# EAGLE design cytron dip (EAGLE 9.3.1)
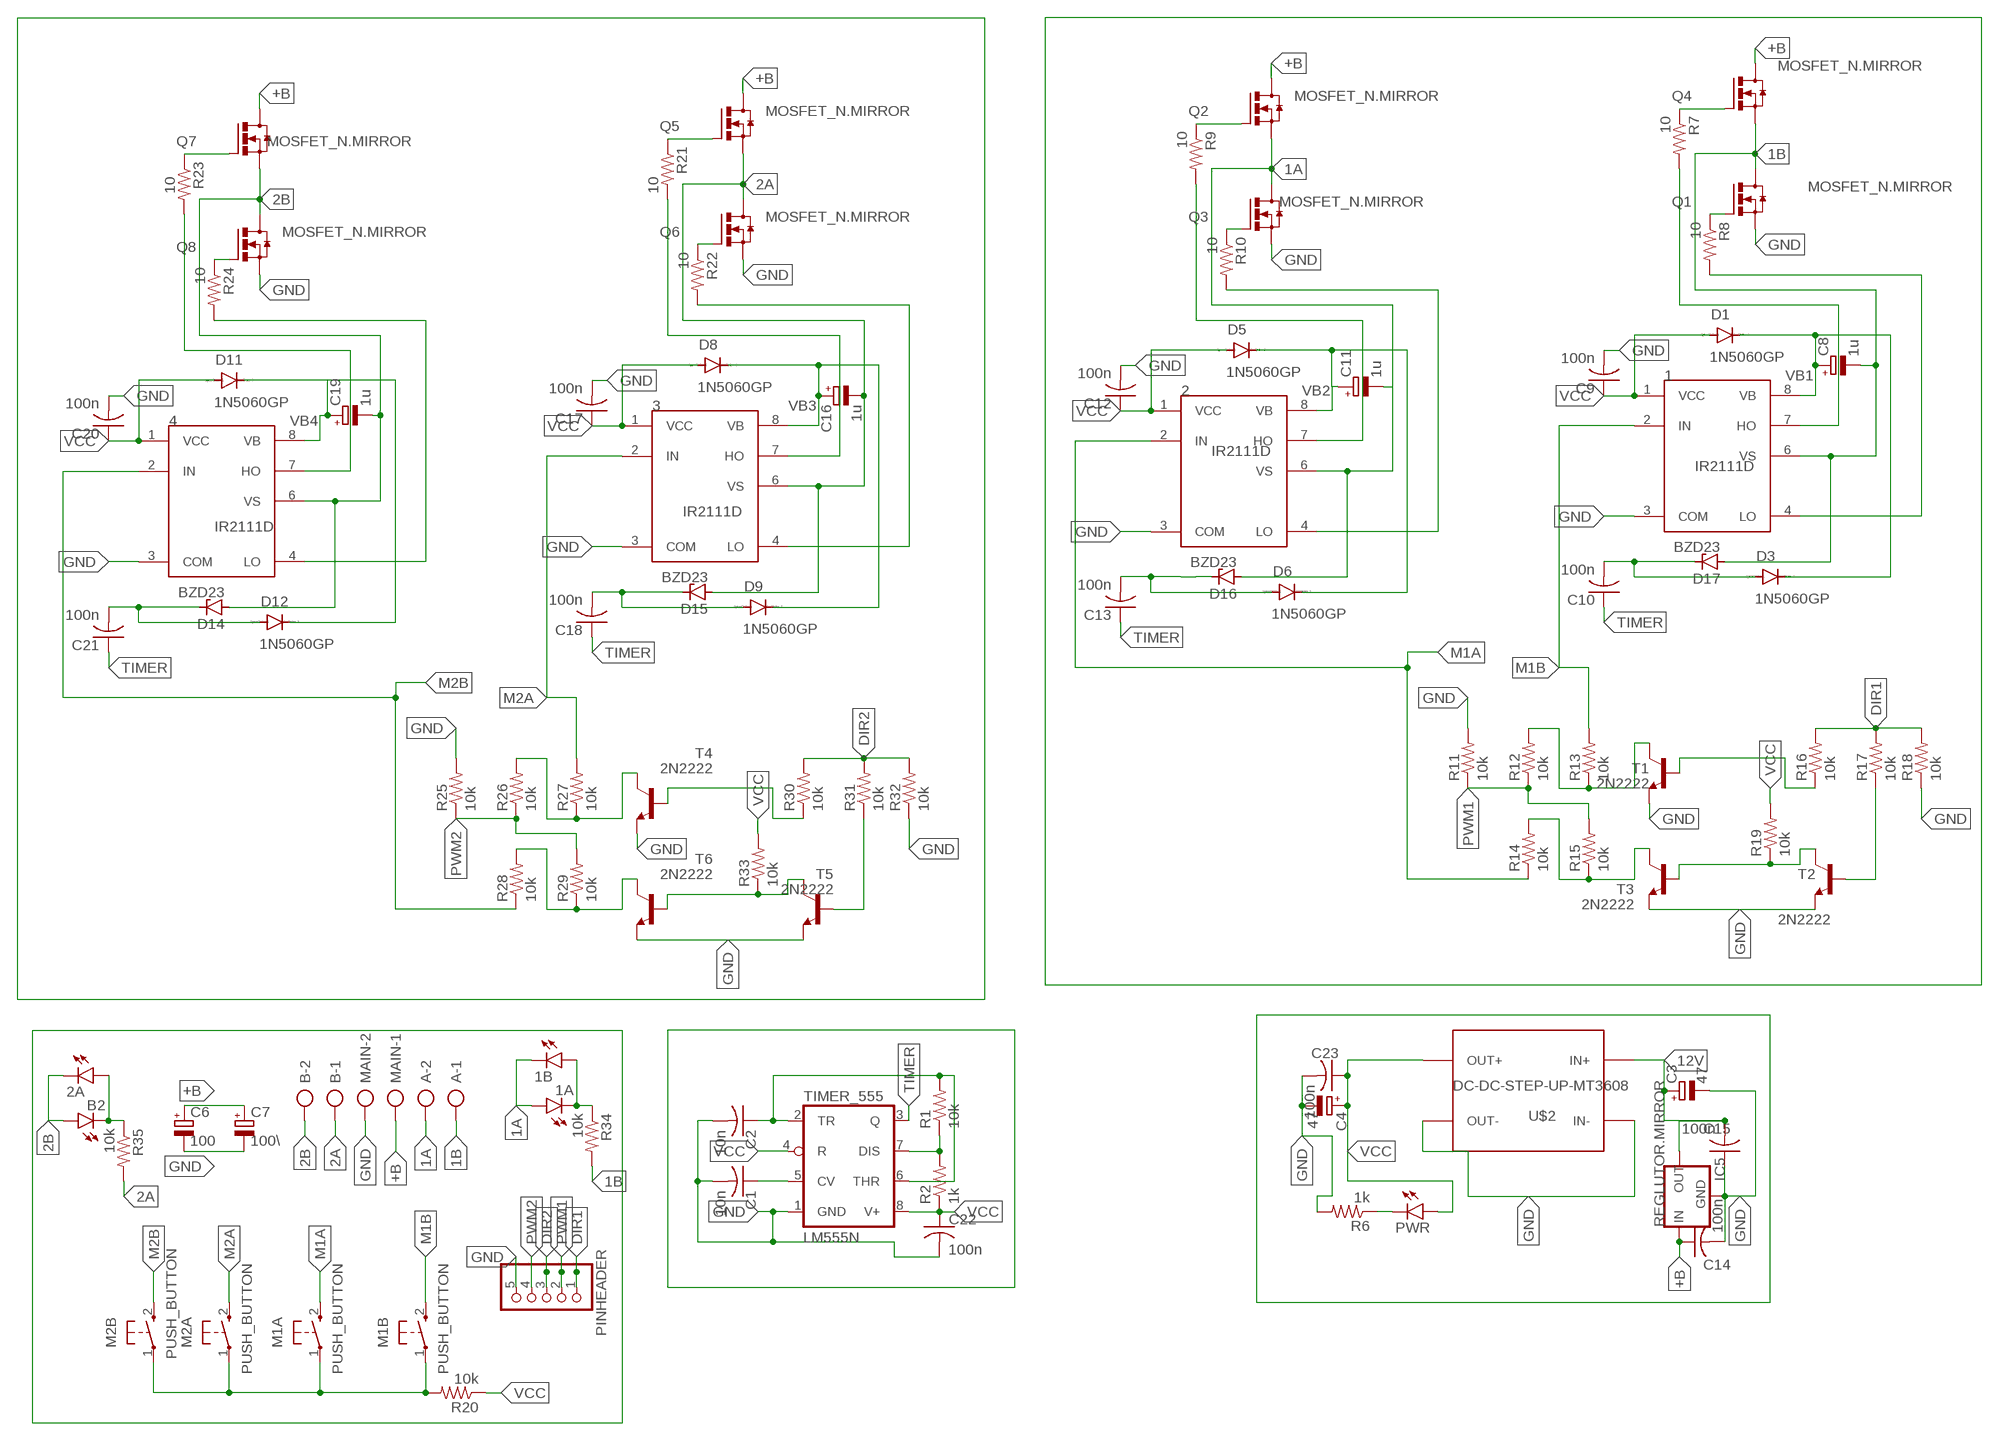
[diagram p0: schematic, sheet 1]

## Parts
1  IR2111D  [DIL08]
1A  LED3MM  [LED3MM]
1B  LED3MM  [LED3MM]
2  IR2111D  [DIL08]
2A  LED3MM  [LED3MM]
3  IR2111D  [DIL08]
4  IR2111D  [DIL08]
A  AK300/22  [XTALRR488W60L1090T465H350B]
B  AK300/22  [XTALRR488W60L1090T465H350B]
B2  LED3MM  [LED3MM]
C1  10n  C-US025-025X050  [C025-025X050]
C2  10n  C-US025-025X050  [C025-025X050]
C3  47  CPOL-EUE5-10.5  [E5-10,5]
C4  47  CPOL-EUE5-10.5  [E5-10,5]
C6  100  CPOL-EUE5-10.5  [E5-10,5]
C7  100\  CPOL-EUE5-10.5  [E5-10,5]
C8  1u  CPOL-EUE5-5  [E5-5]
C9  100n  C-US025-025X050  [C025-025X050]
C10  100n  C-US025-025X050  [C025-025X050]
C11  1u  CPOL-EUE5-5  [E5-5]
C12  100n  C-US025-025X050  [C025-025X050]
C13  100n  C-US025-025X050  [C025-025X050]
C14  100n  C-US025-025X050  [C025-025X050]
C15  100n  C-US025-025X050  [C025-025X050]
C16  1u  CPOL-EUE5-5  [E5-5]
C17  100n  C-US025-025X050  [C025-025X050]
C18  100n  C-US025-025X050  [C025-025X050]
C19  1u  CPOL-EUE5-5  [E5-5]
C20  100n  C-US025-025X050  [C025-025X050]
C21  100n  C-US025-025X050  [C025-025X050]
C22  100n  C-US025-025X050  [C025-025X050]
C23  100n  C-US025-025X050  [C025-025X050]
D1  1N5060GP  [DO15-12]
D3  1N5060GP  [DO15-12]
D5  1N5060GP  [DO15-12]
D6  1N5060GP  [DO15-12]
D8  1N5060GP  [DO15-12]
D9  1N5060GP  [DO15-12]
D11  1N5060GP  [DO15-12]
D12  1N5060GP  [DO15-12]
D14  BZD23  [SOD81]
D15  BZD23  [SOD81]
D16  BZD23  [SOD81]
D17  BZD23  [SOD81]
IC5  REGLUTOR.MIRROR  [78XXL.MIRROR]
M1A  PUSH_BUTTON  [B3F-10XX]
M1B  PUSH_BUTTON  [B3F-10XX]
M2A  PUSH_BUTTON  [B3F-10XX]
M2B  PUSH_BUTTON  [B3F-10XX]
MAIN  AK300/22  [XTALRR488W60L1090T465H350B]
PINHEADER  PINHD-1X5  [1X05]
PWR  LED5MM  [LED5MM]
Q1  MOSFET_N.MIRROR  [TO220.MIRROR]
Q2  MOSFET_N.MIRROR  [TO220.MIRROR]
Q3  MOSFET_N.MIRROR  [TO220.MIRROR]
Q4  MOSFET_N.MIRROR  [TO220.MIRROR]
Q5  MOSFET_N.MIRROR  [TO220.MIRROR]
Q6  MOSFET_N.MIRROR  [TO220.MIRROR]
Q7  MOSFET_N.MIRROR  [TO220.MIRROR]
Q8  MOSFET_N.MIRROR  [TO220.MIRROR]
R1  10k  R-US_0204/7  [0204/7]
R2  1k  R-US_0204/7  [0204/7]
R6  1k  R-US_0204/7  [0204/7]
R7  10  R-US_0204/7  [0204/7]
R8  10  R-US_0204/7  [0204/7]
R9  10  R-US_0204/7  [0204/7]
R10  10  R-US_0204/7  [0204/7]
R11  10k  R-US_0204/7  [0204/7]
R12  10k  R-US_0204/7  [0204/7]
R13  10k  R-US_0204/7  [0204/7]
R14  10k  R-US_0204/7  [0204/7]
R15  10k  R-US_0204/7  [0204/7]
R16  10k  R-US_0204/7  [0204/7]
R17  10k  R-US_0204/7  [0204/7]
R18  10k  R-US_0204/7  [0204/7]
R19  10k  R-US_0204/7  [0204/7]
R20  10k  R-US_0204/7  [0204/7]
R21  10  R-US_0204/7  [0204/7]
R22  10  R-US_0204/7  [0204/7]
R23  10  R-US_0204/7  [0204/7]
R24  10  R-US_0204/7  [0204/7]
R25  10k  R-US_0204/7  [0204/7]
R26  10k  R-US_0204/7  [0204/7]
R27  10k  R-US_0204/7  [0204/7]
R28  10k  R-US_0204/7  [0204/7]
R29  10k  R-US_0204/7  [0204/7]
R30  10k  R-US_0204/7  [0204/7]
R31  10k  R-US_0204/7  [0204/7]
R32  10k  R-US_0204/7  [0204/7]
R33  10k  R-US_0204/7  [0204/7]
R34  10k  R-US_0204/7  [0204/7]
R35  10k  R-US_0204/7  [0204/7]
T1  2N2222  [TO18]
T2  2N2222  [TO18]
T3  2N2222  [TO18]
T4  2N2222  [TO18]
T5  2N2222  [TO18]
T6  2N2222  [TO18]
TIMER_555  LM555N  [DIL08]
U$2  DC-DC-STEP-UP-MT3608  [DC-DC-STEP-UP-MT3608]

## Nets
1A: 1A.A 1B.K(C) 2.6(VS) A.2 C11.- D16.A Q2.S Q3.D
1B: 1.6(VS) A.1 C8.- D17.A Q1.D Q4.S R34.2
2A: 3.6(VS) B.1 C16.- D15.A Q5.S Q6.D R35.2
2B: 2A.K(C) 4.6(VS) B2.A B.2 C19.- D14.A Q7.S Q8.D
12V: C3.+ C15.2 IC5.OUT U$2.IN+
+B: C6.+ C7.+ C14.1 IC5.IN MAIN.1 Q2.D Q4.D Q5.D Q7.D
DIR1: PINHEADER.1 R16.2 R17.2 R18.2
DIR2: PINHEADER.3 R30.2 R31.2 R32.2
GND: 1.3(COM) 2.3(COM) 3.3(COM) 4.3(COM) C1.2 C2.2 C3.- C4.- C6.- C7.- C9.2 C12.2 C14.2 C15.1 C17.2 C20.2 C22.2 C23.2 IC5.GND MAIN.2 PINHEADER.5 Q1.S Q3.S Q6.S Q8.S R6.2 R11.2 R18.1 R25.2 R32.1 T1.1(E) T2.1(E) T3.1(E) T4.1(E) T5.1(E) T6.1(E) TIMER_555.1(GND) U$2.IN- U$2.OUT-
M1A: 2.2(IN) M1A.2(S) R14.1
M1B: 1.2(IN) M1B.2(S) R13.2
M2A: 3.2(IN) M2A.2(S) R27.2
M2B: 4.2(IN) M2B.2(S) R28.1
N$1: PWR.K(C) R6.1
N$2: C1.1 TIMER_555.5(CV)
N$3: R1.1 R2.2 TIMER_555.7(DIS)
N$4: C2.1 R1.2 TIMER_555.2(TR) TIMER_555.6(THR)
N$6: Q6.G R22.1
N$7: M1A.1(P) M1B.1(P) M2A.1(P) M2B.1(P) R20.2
N$9: Q4.G R7.1
N$10: Q1.G R8.1
N$12: 1.4(LO) R8.2
N$13: 1.7(HO) R7.2
N$14: C10.2 D3.A D17.C
N$15: Q3.G R10.1
N$16: Q2.G R9.1
N$17: 2.4(LO) R10.2
N$18: 2.7(HO) R9.2
N$19: R16.1 T1.2(B)
N$20: C13.2 D6.A D16.C
N$22: R14.2 R15.1 T3.3(C)
N$24: R12.2 R13.1 T1.3(C)
N$25: Q5.G R21.1
N$26: 3.4(LO) R22.2
N$27: R19.1 T2.3(C) T3.2(B)
N$28: R17.1 T2.2(B)
N$30: 3.7(HO) R21.2
N$31: C18.2 D9.A D15.C
N$32: Q8.G R24.1
N$33: Q7.G R23.1
N$34: 4.4(LO) R24.2
N$35: 4.7(HO) R23.2
N$36: C21.2 D12.A D14.C
N$37: R28.2 R29.1 T6.3(C)
N$38: R26.2 R27.1 T4.3(C)
N$39: R30.1 T4.2(B)
N$40: R33.1 T5.3(C) T6.2(B)
N$41: R31.1 T5.2(B)
N$45: 1A.K(C) 1B.A R34.1
N$46: 2A.A B2.K(C) R35.1
PWM1: PINHEADER.2 R11.1 R12.1 R15.2
PWM2: PINHEADER.4 R25.1 R26.1 R29.2
TIMER: C10.1 C13.1 C18.1 C21.1 TIMER_555.3(Q)
VB1: 1.8(VB) C8.+ D1.C D3.C
VB2: 2.8(VB) C11.+ D5.C D6.C
VB3: 3.8(VB) C16.+ D8.C D9.C
VB4: 4.8(VB) C19.+ D11.C D12.C
VCC: 1.1(VCC) 2.1(VCC) 3.1(VCC) 4.1(VCC) C4.+ C9.1 C12.1 C17.1 C20.1 C22.1 C23.1 D1.A D5.A D8.A D11.A PWR.A R2.1 R19.2 R20.1 R33.2 TIMER_555.4(R) TIMER_555.8(V+) U$2.OUT+

## Library data of the parts
1-4 = irs:IR2111
1A 1B 2A B2 PWR = led:LED: LED OSRAM: - CHIPLED LG R971, LG N971, LY N971, LG Q971, LY Q971, LO R971, LY R971 LH N974, LH R974 LS Q976, LO Q976, LY Q976 LO Q996 - Hyper CHIPLED LW Q18S LB Q993, LB Q99A, LB R99A - SideLED LS A670, LO A670, LY A670, LG A670, LP A670 LB A673, LV A673, LT A673, LW A673 LH A674 LY A675 LS A676, LA A676, LO A676, LY A676, LW A676 LS A679, LY A679, LG A679 - Hyper Micro SIDELED® LS Y876, LA Y876, LO Y876, LY Y876 LT Y87S - SmartLED LW L88C, LW L88S LB L89C, LB L89S, LG L890 LS L89K, LO L89K, LY L89K LS L896, LA L896, LO L896, LY L896 - TOPLED LS T670, LO T670, LY T670, LG T670, LP T670 LSG T670, LSP T670, LSY T670, LOP T670, LYG T670 LG T671, LOG T671, LSG T671 LB T673, LV T673, LT T673, LW T673 LH T674 LS T676, LA T676, LO T676, LY T676, LB T676, LH T676, LSB T676, LW T676 LB T67C, LV T67C, LT T67C, LS T67K, LO T67K, LY T67K, LW E67C LS E67B, LA E67B, LO E67B, LY E67B, LB E67C, LV E67C, LT E67C LW T67C LS T679, LY T679, LG T679 LS T770, LO T770, LY T770, LG T770, LP T770 LB T773, LV T773, LT T773, LW T773 LH T774 LS E675, LA E675, LY E675, LS T675 LS T776, LA T776, LO T776, LY T776, LB T776 LHGB T686 LT T68C, LB T68C - Hyper Mini TOPLED® LB M676 - Mini TOPLED Santana® LG M470 LS M47K, LO M47K, LY M47K Source: http://www.osram.convergy.de LUXEON: - LUMILED® LXK2-PW12-R00, LXK2-PW12-S00, LXK2-PW14-U00, LXK2-PW14-V00 LXK2-PM12-R00, LXK2-PM12-S00, LXK2-PM14-U00 LXK2-PE12-Q00, LXK2-PE12-R00, LXK2-PE12-S00, LXK2-PE14-T00, LXK2-PE14-U00 LXK2-PB12-K00, LXK2-PB12-L00, LXK2-PB12-M00, LXK2-PB14-N00, LXK2-PB14-P00, LXK2-PB14-Q00 LXK2-PR12-L00, LXK2-PR12-M00, LXK2-PR14-Q00, LXK2-PR14-R00 LXK2-PD12-Q00, LXK2-PD12-R00, LXK2-PD12-S00 LXK2-PH12-R00, LXK2-PH12-S00 LXK2-PL12-P00, LXK2-PL12-Q00, LXK2-PL12-R00 Source: www.luxeon.com KINGBRIGHT: KA-3528ASYC Source: www.kingbright.com
A B MAIN = con-ptr50056:AK300/2: CONNECTOR
C1 C2 C9 C10 C12-C15 C17 C18 C20-C23 = rcl8:C-US: CAPACITOR, American symbol; SPICEPREFIX: C
C3 C4 C6-C8 C11 C16 C19 = rcl8:CPOL-EU: POLARIZED CAPACITOR, European symbol; SPICEPREFIX: C
D1 D3 D5 D6 D8 D9 D11 D12 = diode:1N5060GP: DIODE controlled avalanche rectifier
D14-D17 = diode:BZD23: Z DIODE
IC5 = MOSFET MIRROR:REGLUTOR.MIRROR
M1A M1B M2A M2B = MIA_LIBRARY (1):PUSH_BUTTON: OMRON SWITCH
PINHEADER = pinhead:PINHD-1X5: PIN HEADER
Q1-Q8 = MIA_LIBRARY (1):MOSFET_N.MIRROR
R1 R2 R6-R35 = rcl8:R-US_: RESISTOR, American symbol; SPICEPREFIX: R
T1-T6 = transistor:2N2222: NPN TRANSISTOR
TIMER_555 = linear:*555: TIMER
U$2 = diy-modules:DC-DC-STEP-UP-MT3608: DC/DC Step-Up Regulator based on MT3608 chip MT3608 datasheet available here: https://www.olimex.com/Products/Breadboarding/BB-PWR-3608/resources/MT3608.pdf Click here to find device on ebay.com <http://www.ebay.com/sch/mt3608+module>

## Board
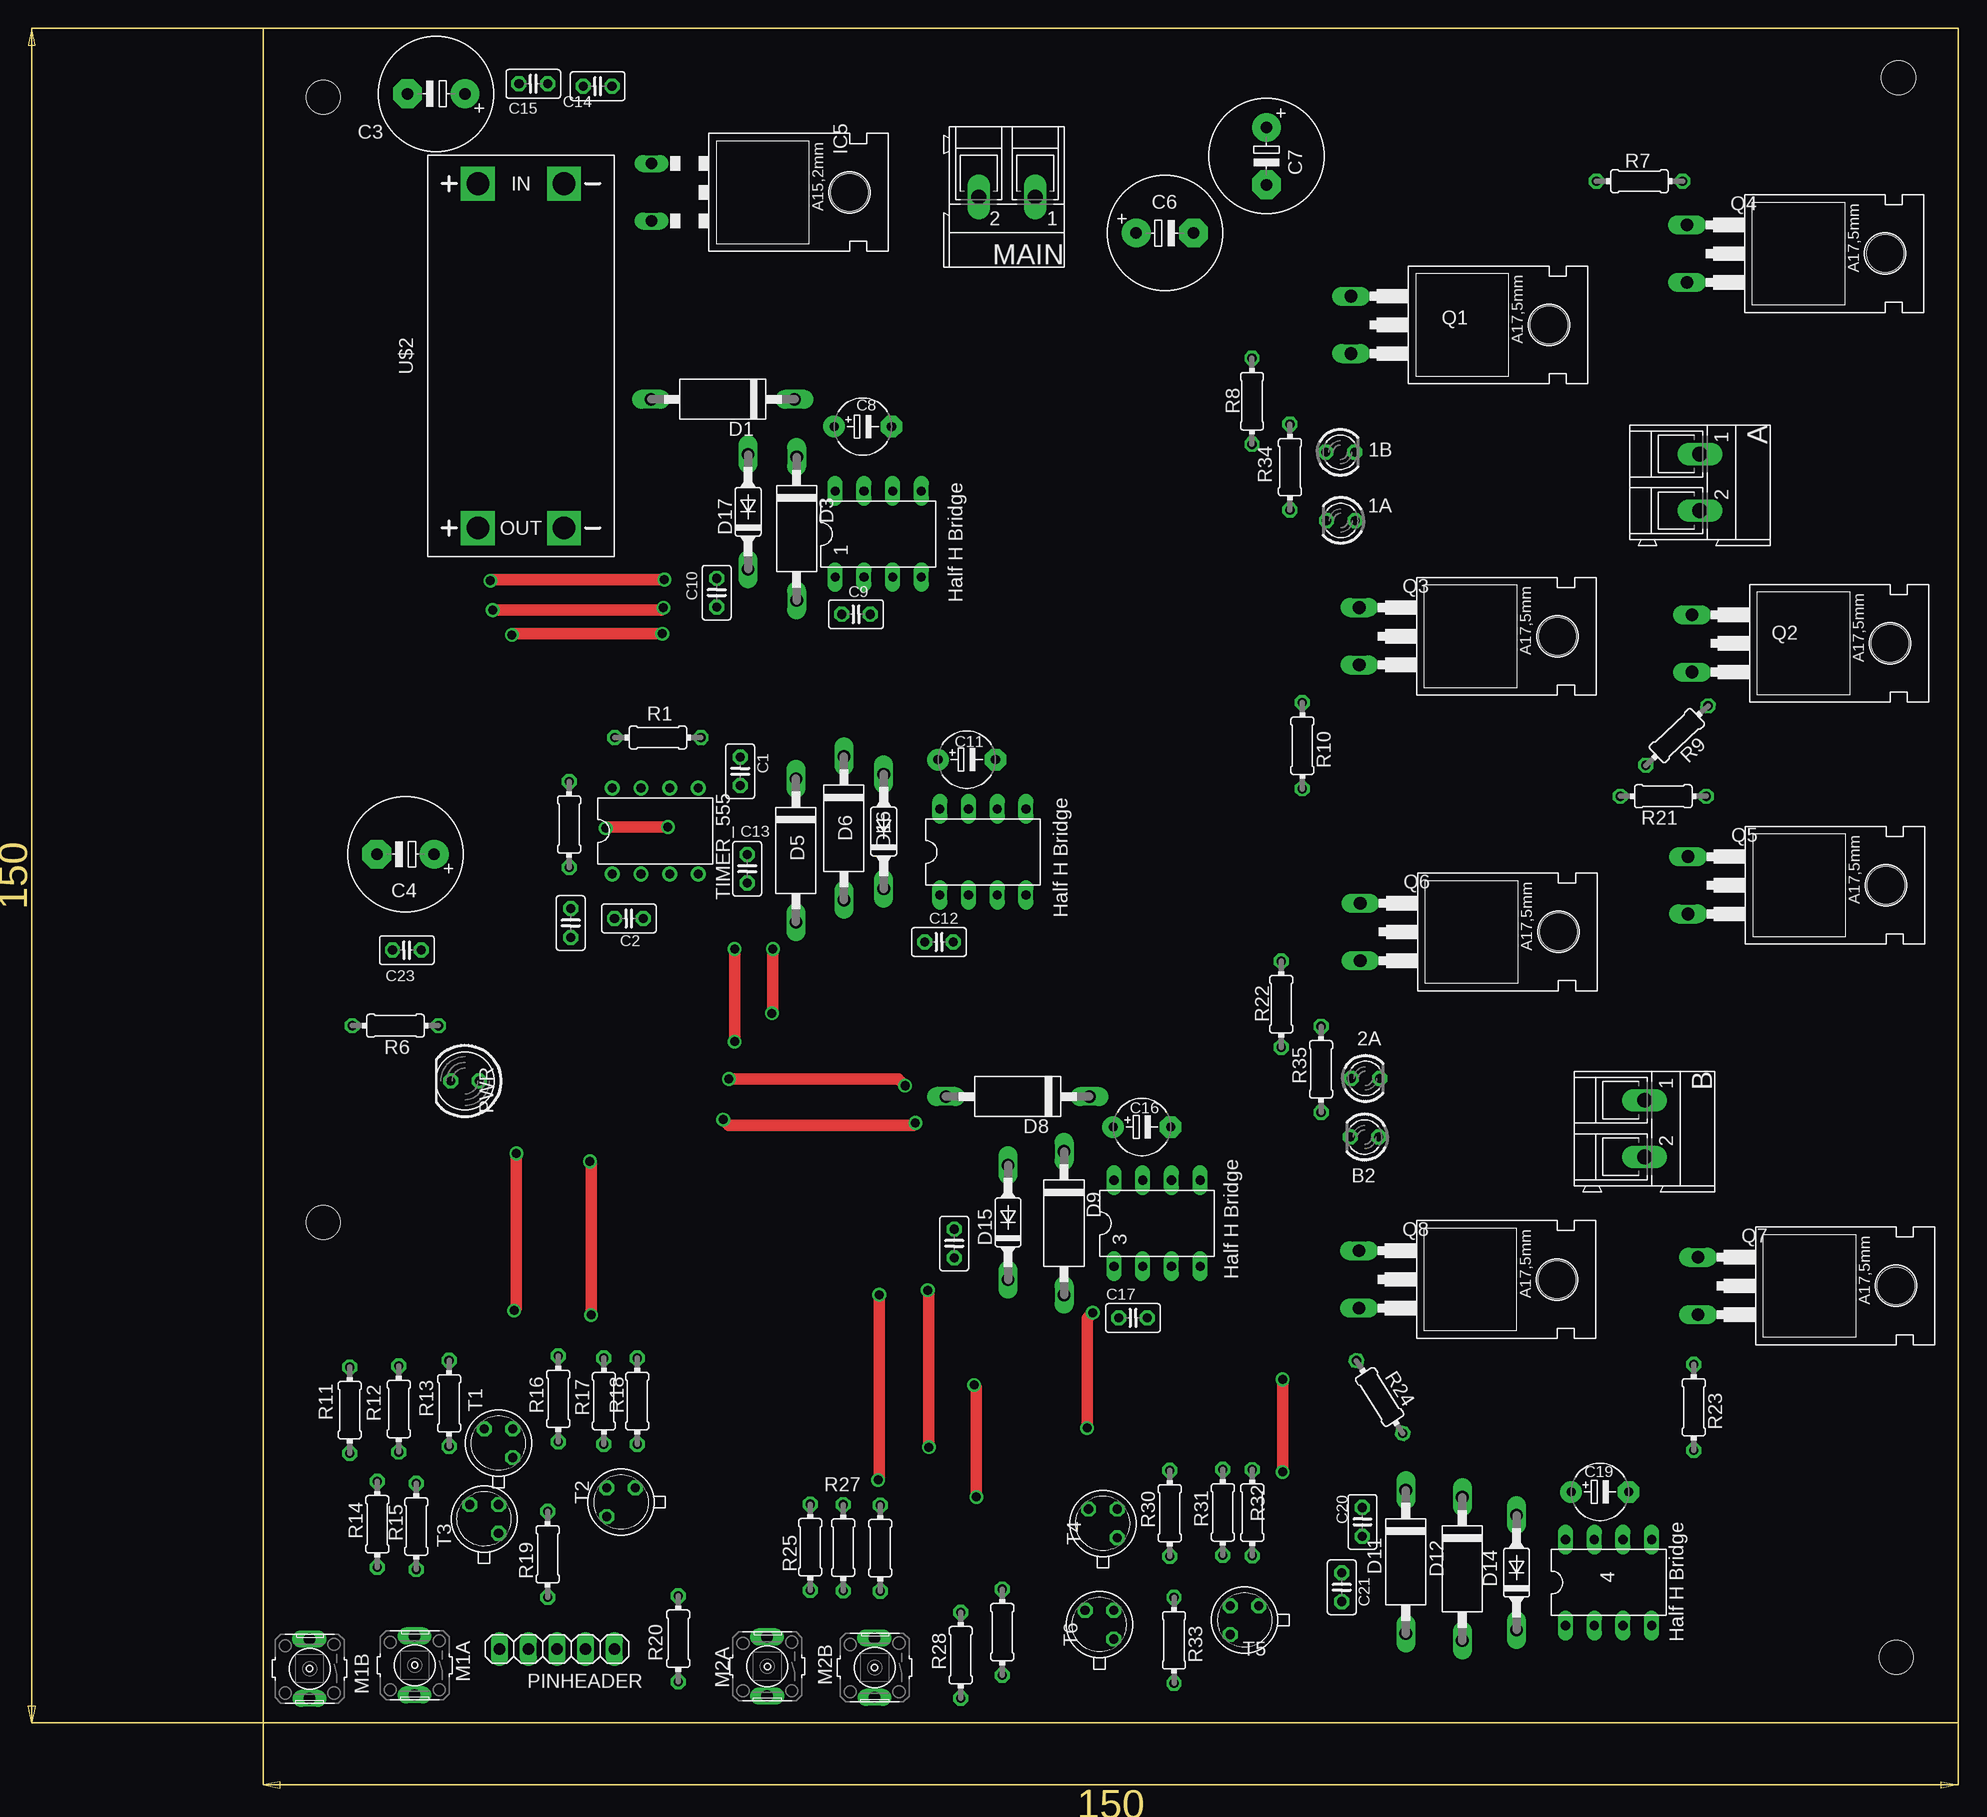
[diagram p1: board, top side]
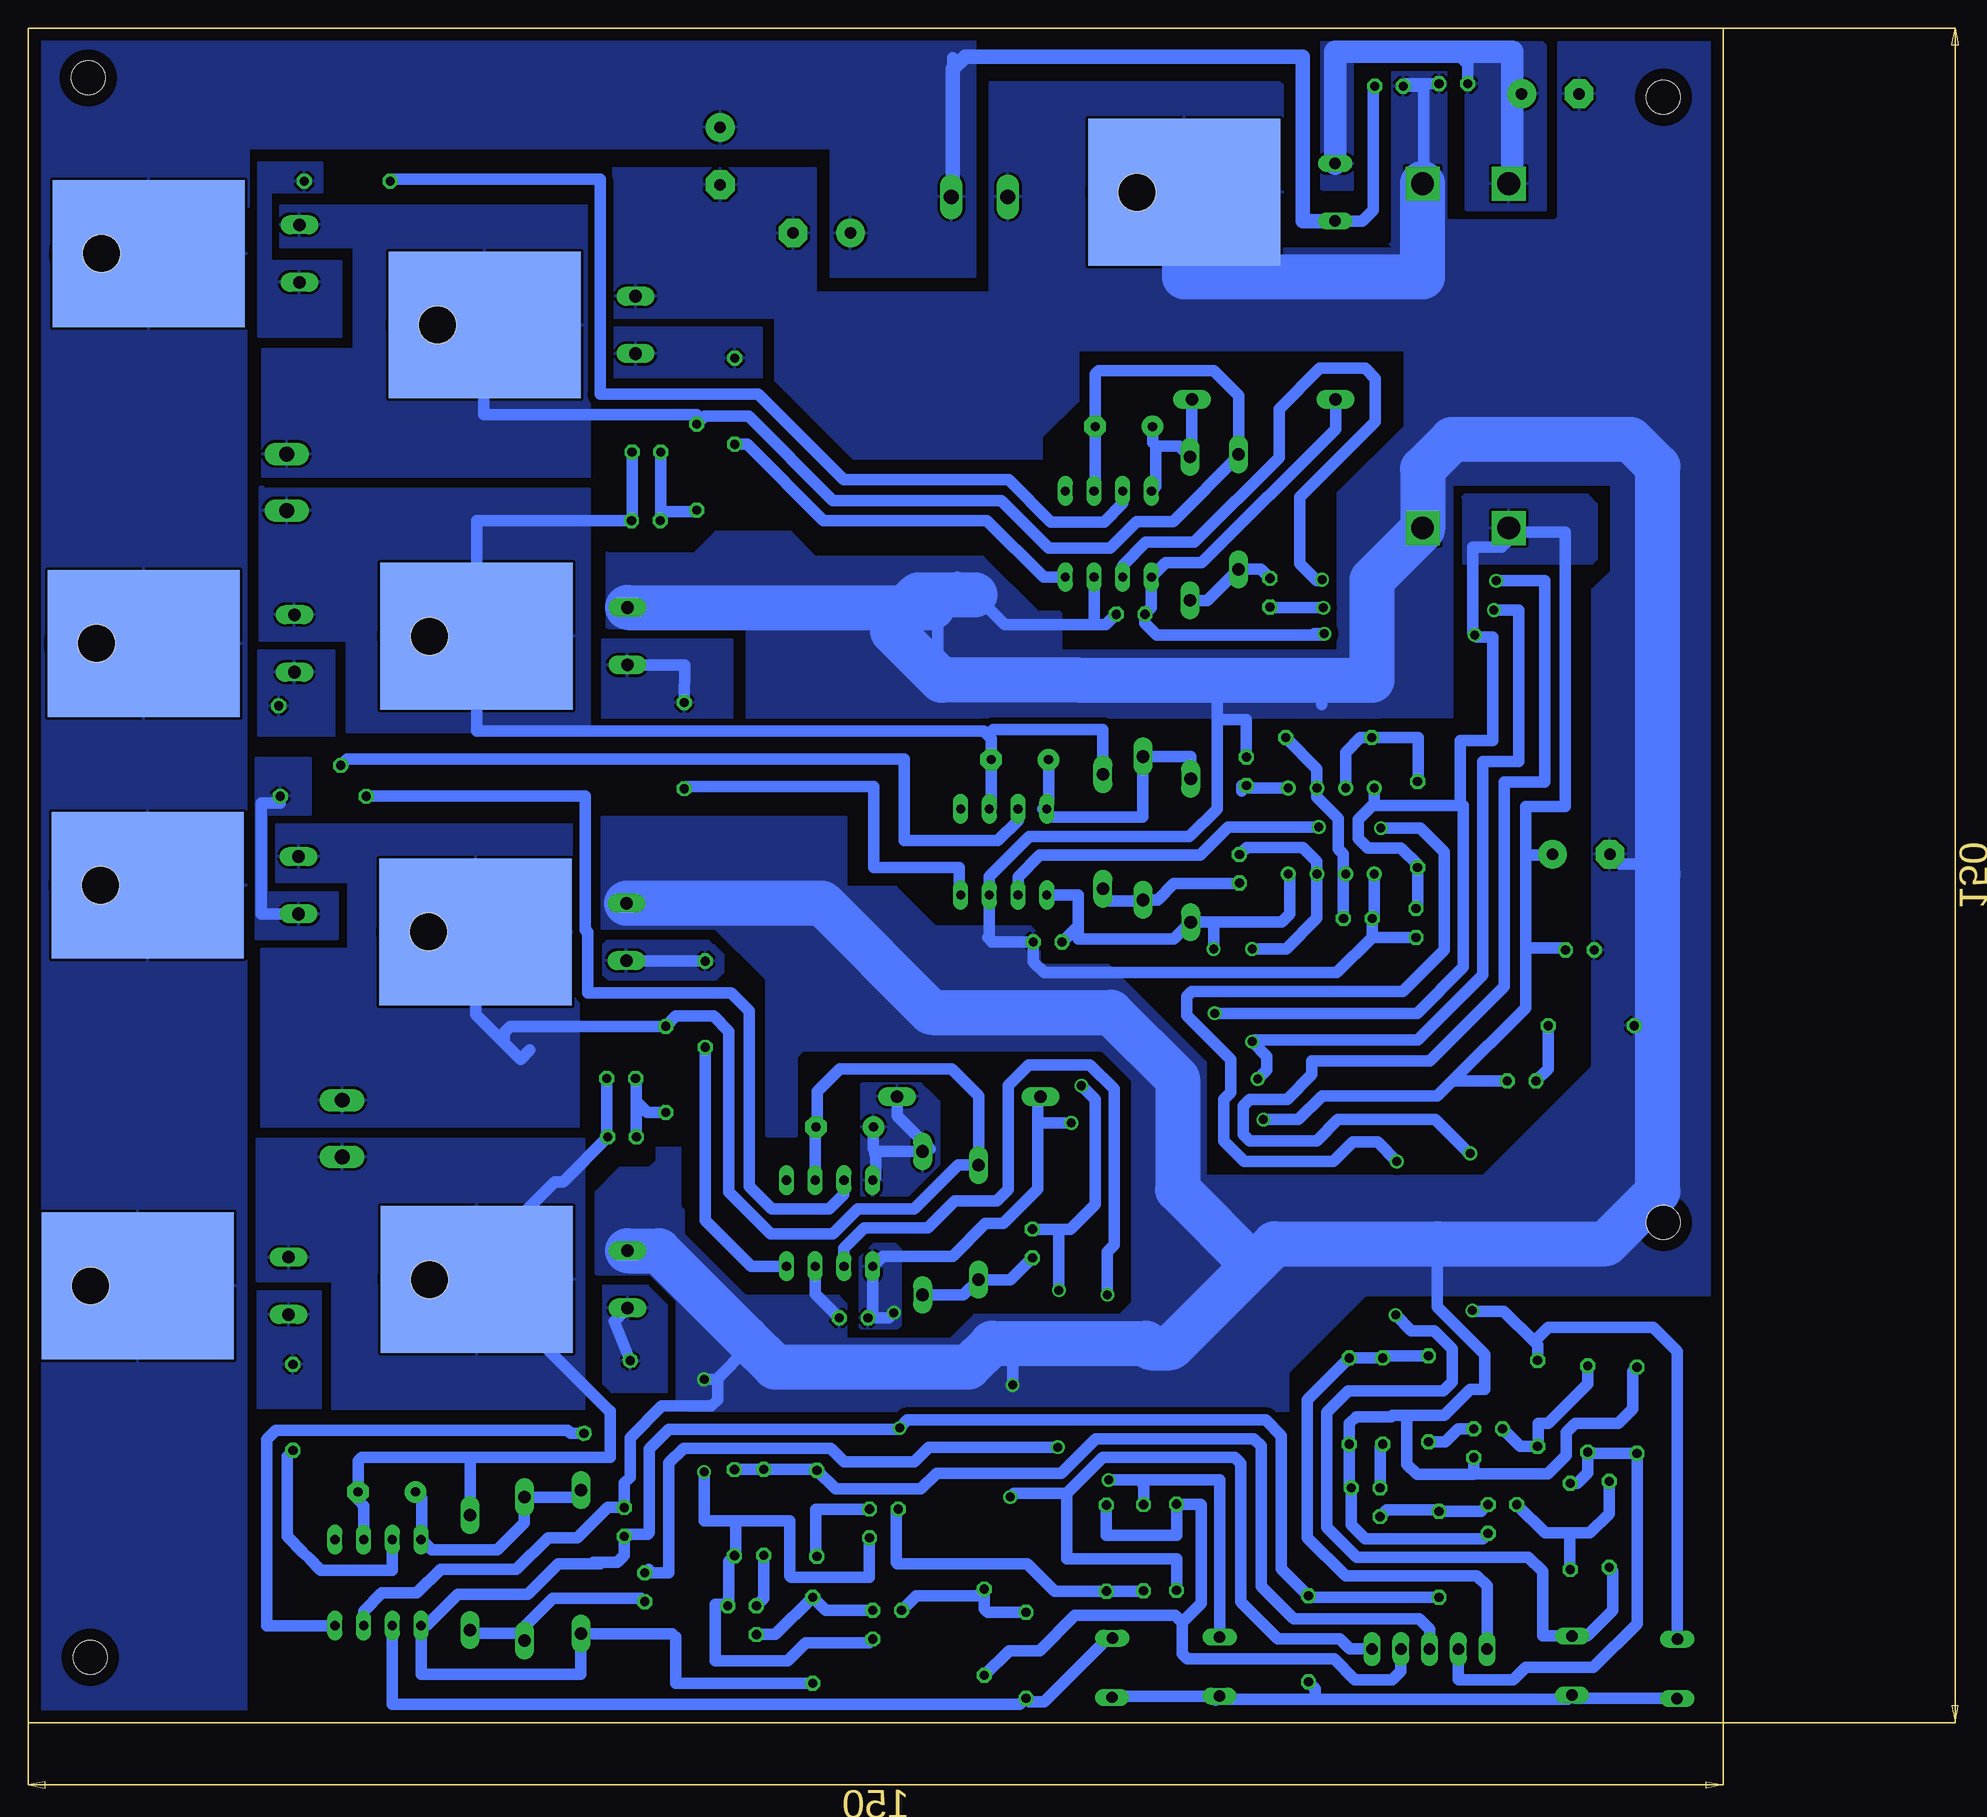
[diagram p2: board, bottom side, seen from below]

Size 150 x 150 mm. Coordinates in mm from the lower left corner, seen from the top.
Outline: 0,0 0,150 150,150 150,0 0,0
Copper layers (1*16): Top 0.035mm / dielectric 1.5mm / Bottom 0.035mm
Design rules "default *": minimum track width 0.015240625mm, minimum drill 0.8mm, track to track 0.6mm, track to pad 0.6mm, pad to pad 0.6mm, via to via 6mil, smd to smd 6mil, copper to edge 40mil, drill to drill 6mil, minimum pad ring 10mil, minimum via ring 8mil, stop-mask expansion 4mil, vias tented up to drill 0mil, thermal gap 10mil
Holes 3 mm at 144.7,145.6 144.5,5.8 5.3,44.3 5.3,143.9

### Footprints (pad centres in the part's own frame; a part is rotated, then mirrored left to right if it is on the bottom)
DIL08 = drill 0.813 long: 1 -3.81,-3.81; 2 -1.27,-3.81; 3 1.27,-3.81; 4 3.81,-3.81; 5 3.81,3.81; 6 1.27,3.81; 7 -1.27,3.81; 8 -3.81,3.81
LED3MM = drill 0.813 octagon: A -1.27,0; K 1.27,0
XTALRR488W60L1090T465H350B = drill 1.321 long: 1 -2.515,-1.27; 2 2.489,-1.27
C025-025X050 = drill 0.813 octagon: 1 -1.27,0; 2 1.27,0
E5-10,5 = drill 1.016 pad 2.54: + -2.54,0 | drill 1.016 pad 2.54 octagon: - 2.54,0
E5-5 = drill 0.813 pad 1.905: + -2.54,0 | drill 0.813 pad 1.905 octagon: - 2.54,0
DO15-12 = drill 1.118 long: A 6.35,0; C -6.35,0
SOD81 = drill 1.118 long: A 5.08,0; C -5.08,0
78XXL.MIRROR = smd 13 x 17 bottom: GND 0,7 | drill 1.016 long: IN 2.54,-6.35; OUT -2.54,-6.35 | hole 3.302: 0,11.176
B3F-10XX = drill 1.016 long: 1 0.013,2.636; 2 0.029,-2.605
1X05 = drill 1.016 long: 1 -5.08,0; 2 -2.54,0; 3 0,0; 4 2.54,0; 5 5.08,0
LED5MM = drill 0.813 octagon: A -1.27,0; K 1.27,0
TO220.MIRROR = smd 13 x 17 bottom: D 0,7 | drill 1.118 long: G 2.54,-6.35; S -2.54,-6.35 | hole 3.302: 0,11.176
0204/7 = drill 0.813 octagon: 1 -3.81,0; 2 3.81,0
TO18 = drill 0.813 octagon: 1 -1.27,-1.27; 2 1.27,-1.27; 3 1.27,1.27
DIL08' = drill 0.813 pad 1.27: 1 -3.81,-3.81; 2 -1.27,-3.81; 3 1.27,-3.81; 4 3.81,-3.81; 5 3.81,3.81; 6 1.27,3.81; 7 -1.27,3.81; 8 -3.81,3.81
DC-DC-STEP-UP-MT3608 = drill 2 pad 2.8 square: IN+ 15.24,3.81; IN- 15.24,-3.81; OUT+ -15.24,3.81; OUT- -15.24,-3.81

### Placement (x,y rotation side)
1  54.42,105.23 0 top
1A  95.35,106.43 180 top
1B  95.3,112.47 0 top
2  63.68,77.09 0 top
2A  97.53,57.05 0 top
3  79.09,44.22 0 top
4  119.05,12.42 0 top
A  128.4,109.8 270 top
B  123.5,52.6 270 top
B2  97.45,51.85 180 top
C1  42.2,84.23 90 top
C2  32.35,71.2 180 top
C3  15.3,144.2 180 top
C4  12.58,76.89 180 top
C6  79.78,131.87 0 top
C7  88.77,138.69 270 top
C8  53.05,114.74 0 top
C9  52.45,98.13 0 top
C10  40.12,100.04 90 top
C11  62.25,85.26 0 top
C12  59.79,69.12 0 top
C13  42.82,75.6 270 top
C14  29.59,144.87 180 top
C15  23.89,145.08 180 top
C16  77.75,52.74 0 top
C17  76.96,35.84 0 top
C18  61.14,42.43 270 top
C19  118.28,20.44 0 top
C20  97.26,17.79 90 top
C21  95.44,12 270 top
C22  27.2,70.8 270 top
C23  12.7,68.4 180 top
D1  40.67,117.16 180 top
D3  47.2,105.7 270 top
D5  47.13,77.23 270 top
D6  51.37,79.19 270 top
D8  66.76,55.44 180 top
D9  70.86,44.23 270 top
D11  101.1,14.25 270 top
D12  106.1,13.62 270 top
D14  110.9,13.3 90 top
D15  65.9,44.3 90 top
D16  54.9,78.9 90 top
D17  42.9,107.2 90 top
IC5  40.7,135.48 270 top
M1A  13.4,5.1 180 top
M1B  4.1,4.8 180 top
M2A  44.6,5 180 top
M2B  54.1,4.9 180 top
MAIN  65.8,133.8 180 top
PINHEADER  25.99,6.54 0 top
PWR  17.85,56.81 180 top
Q1  102.6,123.74 270 top
Q2  132.79,95.55 270 top
Q3  103.33,96.18 270 top
Q4  132.35,130.05 270 top
Q5  132.42,74.14 270 top
Q6  103.42,70.01 270 top
Q7  133.32,38.68 270 top
Q8  103.32,39.25 270 top
R1  34.92,87.22 0 top
R2  27.06,79.52 90 top
R6  11.69,61.71 180 top
R7  121.78,136.46 180 top
R8  87.49,116.98 270 top
R9  125.09,87.39 223.7 top
R10  91.95,86.49 270 top
R11  7.64,27.68 90 top
R12  11.99,27.78 90 top
R13  16.44,28.28 90 top
R14  10.09,17.58 90 top
R15  13.54,17.38 90 top
R16  26.09,28.68 90 top
R17  30.14,28.48 90 top
R18  33.09,28.48 90 top
R19  25.16,14.92 270 top
R20  36.71,7.45 270 top
R21  123.89,82.02 180 top
R22  90.08,63.61 270 top
R23  126.58,27.93 270 top
R24  98.78,28.85 302.5 top
R25  48.39,15.55 270 top
R26  54.59,15.47 270 top
R27  51.31,15.51 90 top
R28  61.71,5.99 90 top
R29  65.39,8.03 270 top
R30  80.21,18.55 90 top
R31  84.91,18.63 90 top
R32  87.51,18.61 90 top
R33  80.59,7.31 270 top
R34  90.85,111.15 90 top
R35  93.6,57.85 90 top
T1  20.81,24.75 90 top
T2  31.65,19.53 180 top
T3  19.55,18.05 90 top
T4  74.29,17.65 90 top
T5  86.83,9.09 180 top
T6  73.99,8.69 90 top
TIMER_555  LM555N  [DIL08']  34.69,78.95 0 top
U$2  22.8,121 90 top

### Tracks (layer width: path | path; a pad name or v marks a point on that pad's centre or on a via)
1A
  Bottom 1.016: 1B.K 96.57,106.43 1A.A 110.33,106.43 Q3.D 110.33,87.8 65.45,87.8 65.09,87.44 | D16.A 54.9,87.9 64.63,87.9 65.09,87.44 | 65.09,87.44 64.79,87.14 C11.- 64.79,81.06 2.6
  pour Bottom (isolate 0.406): 100.3,109.2 129.2,109.2 129.2,109.4 129.5,109.4 129.5,95.8 121.8,95.8 121.8,87.7 100.3,87.7
1B
  Bottom 1.016: Q1.D 109.08,123.74 109.08,121.79 109.7,121.17 109.7,115.8 101.02,115.8 101.02,115.78 90.85,115.78 R34.2 90.15,115.66 86.25,115.66 78.8,108.2 63.91,108.2 59.7,104 54.25,104 51.9,106.35 48.7,106.35 42.84,112.22 D17.A 42.9,117.5 45.1,119.7 55.29,119.7 55.59,119.4 C8.- 55.59,109.14 1.6
  pour Bottom (isolate 0.406): 127.7,130.6 121.2,130.6 121.2,121.6 129.3,121.6 129.3,110.3 100.3,110.3 100.3,134.3 127.7,134.3
2A
  Bottom 1.016: 105.6,59.56 106.43,58.73 107.9,60.2 | 107.9,60.2 110.42,62.72 Q6.D | 107.9,60.2 107.9,61.1 107.34,61.66 R35.2 92.7,62.56 89.36,62.56 88,61.2 88,47 84.3,43.3 78.8,43.3 76.6,45.5 71.58,45.5 67.7,49.38 D15.A 65.9,55.5 68.3,57.9 78.19,57.9 80.19,55.9 80.19,52.84 C16.- 80.36,52.67 3.6
  pour Bottom (isolate 0.406): 128.05,79.5 128.05,74.45 121.7,74.45 121.7,68.5 129.4,68.5 129.4,52.8 101.3,52.8 101.3,79.5
2B
  Bottom 1.016: Q8.D 110.47,39.1 111.1,39.1 111.1,40.2 103.4,47.9 102.67,47.9 B2.A 98.8,51.93 2A.K | 110.9,23.5 D14.A | 110.9,23.5 120.5,23.5 120.82,23.18 C19.- 120.82,19.72 120.3,19.2 120.3,16.25 4.6 | Q8.D 106.02,39.25 | Q8.D 110.25,39.25 98.6,27.6 98.5,27.6 98.5,23.5 110.9,23.5
  pour Bottom (isolate 0.406): 129.8,39.1 123.1,39.1 123.1,27.8 100.8,27.8 100.8,51.7 129.8,51.7
12V
  Bottom 1.016: C15.2 22.62,146.82 23.7,147.9
  Bottom 2: IC5.OUT 34.35,147.9 23.7,147.9 18.69,147.9 18.69,136.54 U$2.IN+
  pour Bottom (isolate 0.406): 22.8,147.1 22.8,134 22.7,133.9 15.7,133.9 15.7,148.5 16.2,149 35.4,149 35.6,148.8 35.6,135.8 35.5,135.7 32.8,135.7 32.8,146.8 33.1,147.1
+B
  Bottom 0.406: 143.51,95.6 142.6,95.6 142.3,95.6 142.3,92.9 144.2,92.9
  Bottom 1.016: 68.2,147.4 68.2,146.4 | 68.2,136.1 68.5,135.8 68.5,135.25 MAIN.1 | C14.1 31,144.73 31,133.9 31.96,132.94 IC5.IN | Q2.D 142.55,95.55 142.6,95.6
  Bottom 1.27: 68.2,136.1 68.2,146.4 67.1,147.5 37.2,147.5 37.2,132.94 IC5.IN
  pour Bottom (isolate 0.406): 66.2,149.8 66.2,128 79,128 79,139.4 130.5,139.4 130.5,134.2 130.7,134 130.7,0.7 149.2,0.7 149.2,149.8
DIR1
  Bottom 1.016: R16.2 29.94,32.49 R17.2 R18.2 36.8,28.58 36.8,16.4 33.4,13 21.8,13 20.91,12.11 PINHEADER.1
DIR2
  Bottom 1.016: R32.2 84.93,22.42 R31.2 80.29,22.44 R30.2 78.55,20.7 71,20.7 69.6,22.1 58.6,22.1 55.55,25.15 41.55,25.15 40.9,24.5 40.9,12.1 38,9.2 26.9,9.2 25.99,8.29 PINHEADER.3
GND  (via drill 0.8)
  Top 1.016: v90.2,22.2 v90.2,30.4 | v63.1,20 63.1,29.7 v62.9,29.9
  Bottom 1.016: 69.52,99.72 70,99.23 70,98.72 | 69.52,99.72 67.8,101.43 66.24,99.86 63.57,97.2 55.4,97.2 | 56.85,92.35 56.9,92.3 69.52,92.3 69.52,99.72 | C9.2 54.65,97.2 55.4,97.2 | 35.55,92.3 35.55,90.15 | TIMER_555.1 30.88,71.2 C2.2 31.08,69.52 | 31.08,69.52 34.2,66.4 60.1,66.4 61.06,67.36 C12.2 64.72,69.12 65.1,69.5 64.95,69.65 2.3 64.95,74.9 61.4,78.45 47.25,78.45 44.8,80.9 44.8,88.8 | 55.4,97.2 55.69,97.49 1.3 | C15.1 28.11,145.08 C14.2 26.52,144.87 26.52,136.33 U$2.IN- | T6.1 75.58,7.1 81.2,7.1 82.8,5.5 89.2,5.5 89.2,10.5 88.38,10.5 88.31,10.57 T5.1 88.01,10.36 88.01,14.3 R32.1 87.4,14.91 87.4,17.9 | T4.1 75.56,12.9 82.5,12.9 82.6,13 82.6,17.9 87.4,17.9 | 45.6,92.3 44.8,91.5 44.8,88.8 | C22.2 31.07,69.53 31.08,69.52 | C1.2 42.2,88.8 44.8,88.8 | C17.2 80.36,37.97 3.3 | C4.- 9.15,76 6.5,76 5.8,76.7 | 5,77.5 5.8,76.7 | 5.8,76.7 5.8,75.1 | 28,27.2 24.7,27.2 22.4,29.5 21.1,29.5 21.1,32.6 25.3,36.8 25.3,42.4 | 28,27.2 29.3,27.2 29.4,27.1 32.5,27.1 33.09,26.51 R18.1 33.09,20.97 T2.1 32.92,17.52 31.7,16.3 21.3,16.3 T3.1 | 28,27.2 28,22.9 27.1,22 22.1,22 22.1,23.46 T1.1 22.08,22.05 15.55,22.05 13.9,23.7 13.9,25.7 13.1,26.5 9.3,26.5 8,27.8 8,31.13 R11.2 | 120.22,8.51 4.3 120.32,9.88 118.7,11.5 115.6,11.5 113.5,13.6 106.8,13.6 104,16.4 101.4,16.4 98.74,19.06 C20.2 | 89,30.5 89,28.6 89.55,28.05 93.95,28.05 96.75,25.25 96.75,21.75 97.26,21.24 C20.2 | 89,30.5 86.45,33.05 86.45,34.05 | v90.2,30.4 89.1,30.4 89,30.5 | PINHEADER.5 33.04,6.54 33.95,7.45 39.45,7.45 42.7,10.7 42.7,22.95 43.25,23.5 54.9,23.5 58.1,20.3 | R25.2 48.39,14.5 58.1,14.5 58.1,20.3 | v63.1,20 62.8,20.3 58.1,20.3 | v62.9,29.9 62.9,31.8 64.7,33.6
  Bottom 1.016: 87.4,17.9 90.2,17.9 v90.2,22.2 | C20.2 97.44,19.06
  Bottom 4: Q3.S 70,98.72 | IC5.GND 47.7,128 26.61,128 U$2.IN- | 66.24,99.86 71.24,99.86 73.5,97.6 73.5,96.6 69.2,92.3 56.9,92.3 45.6,92.3 35.55,92.3 31.11,92.3 31.11,101.16 26.61,105.66 U$2.OUT- 26.61,110.99 24,113.6 8.2,113.6 5.8,111.2 5.8,75.1 5.8,47 10.4,42.4 25.3,42.4 39.7,42.4 41.6,40.5 | Q6.S 79.75,72.55 70.1,62.9 54.2,62.9 48.3,57 48.3,47.2 41.6,40.5 | Q8.S 94.19,41.79 86.45,34.05 83.9,31.5 66.8,31.5 64.7,33.6 51.1,33.6 50.7,33.2 48.9,33.2 41.6,40.5
  pour Bottom (isolate 0.406): 64.9,145.2 64.9,126.6 80.3,126.6 80.3,137.6 98.25,137.6 98.25,124.4 83.9,124.4 83.9,118.8 77,111.9 60.3,111.9 60.3,113.81 57.1,117.01 57.1,145.2
  pour Bottom (isolate 0.406): 39,145 39,121.5 57.7,121.5 57.7,145.2 39.3,145.2 39.1,145
  pour Bottom (isolate 0.406): 98.8,103.6 98.8,97 98.6,97 98.6,96.9 86.4,96.9 86.4,89 30.4,89 30.4,94.9 58.6,94.9 58.6,98.2 58.7,98.3 60.6,98.3 65.5,103.2 80.3,103.2 82.5,105.4 89.2,105.4 91.1,103.5 98.7,103.5
  pour Bottom (isolate 0.406): 44.5,130.5 17.4,130.5 15.6,132.3 14.6,133.3 14.6,137.8 14.6,148.7 14,149.3 1.2,149.3 0.8,148.9 0.8,123.6 0.8,121.5 44.5,121.5
  pour Bottom (isolate 0.406): 31.92,89.02 24,89.02 24,109.6 9.9,109.6 9.9,84.8 0.6,84.8 0.6,125.5 28.2,125.5 28.2,114.8 34.1,108.9 34.1,91.2
  pour Bottom (isolate 0.406): 14.2,133.3 14.5,133 24.5,133 24.5,146.1 29.3,146.1 29.3,131.1 29.5,130.9 26.7,128.1 15,128.1 14.2,128.9
  pour Bottom (isolate 0.406): 99.25,70.3 99.25,80.2 77.6,80.2 77.6,70.3
  pour Bottom (isolate 0.61): 99.8,39.8 99.8,47 97.7,49.1 95.1,49.1 94.4,49.8 94.4,50.9 92.3,50.9 92.3,45.7 92,45.4 92,43.3 86.5,37.8 78.3,37.8 77.6,37.1 77.6,34 68.4,34 66.3,36.1 53.4,36.1 52.3,37.2 52.3,56.8 55,59.5 81.4,59.5 82,58.9 82,52 82.1,51.9 84.6,51.9 84.7,52 84.7,65.8 89.5,70.6 89.6,70.6 89.6,74 73.2,74 66.3,67.1 54.4,67.1 45.8,58.5 45.8,48.4 21.3,48.4 11.6,58.1 11.6,100.3 9.1,102.8 1.6,102.8 1,102.2 1,71.4 1.1,71.3 1.1,37.9 31.6,37.9 38.5,31 38.5,27.6 91.6,27.6 92.6,28.6 92.6,37.3 95,39.7 99.7,39.7
  pour Bottom (isolate 0.406): 71.1,70.5 61.3,70.5 60.5,69.7 60.5,67.3 61.7,66.1 70.8,66.1 71.1,65.8
M1A  (via drill 0.8)
  Top 1.016: v35.8,79.3 30.4,79.3 v30.3,79.2 | v28.9,49.7 29,49.6 v29,36.1
  Bottom 1.016: 2.2 62.41,74.89 60.5,76.8 46.3,76.8 43.8,79.3 v35.8,79.3 | v30.3,79.2 26.8,79.2 24.7,77.1 24.7,68.4 28.35,64.75 47.05,64.75 47.5,64.3 47.5,62.6 43.6,58.7 43.6,55.8 44.2,55.2 44.2,51.5 42.4,49.7 34.5,49.7 32.8,51.4 30.6,51.4 v28.9,49.7 | R14.1 9.8,13.48 9.8,9.96 12.05,7.71 M1A.2 16,7.71 16,13.4 17.25,14.65 32.45,14.65 35.1,17.3 35.1,27.5 33.2,29.4 24.8,29.4 24,30.2 24,33.1 25.6,34.7 27.6,34.7 v29,36.1
M1B  (via drill 0.8)
  Top 1.016: v35.5,101.2 20.2,101.2 v20.1,101.1 | v22.4,50.4 22.4,36.7 v22.2,36.5
  Bottom 1.016: 1.2 53.15,102.45 51.1,104.5 46.8,104.5 39.3,112 39.3,116.3 35.7,119.9 31.7,119.9 30.8,119 30.8,115.2 37.5,108.5 37.5,102.6 36,101.1 35.6,101.1 v35.5,101.2 | v20.1,101.1 15.8,101.1 15.8,83.3 19.4,83.3 19.4,65.2 26,58.6 36.4,58.6 36.4,57.4 38.6,55.2 41.9,55.2 42.5,54.6 42.5,52.1 41.9,51.5 36,51.5 34.1,53.4 25.5,53.4 22.45,50.35 v22.4,50.4 | R13.2 16.44,33.44 16.75,33.75 | v22.2,36.5 22.13,36.43 19.43,36.43 16.75,33.75 | M1B.2 4.07,32.87 6.2,35 15.5,35 16.75,33.75
M2A  (via drill 0.8)
  Top 1.016: v54.5,37.9 54.5,21.6 v54.4,21.5
  Bottom 1.016: 3.2 77.82,41.98 76,43.8 70.4,43.8 68,46.2 64.3,46.2 63.3,47.2 63.3,56.4 61.45,58.25 56.05,58.25 53.9,56.1 53.9,42.3 54.5,41.7 v54.5,37.9 | v54.4,21.5 51.7,21.5 | 51.7,21.5 44.57,21.5 M2A.2 | R27.2 51.31,21.11 51.7,21.5
M2B
  Bottom 1.016: M2B.2 54.48,7.5 60.11,1.88 61.41,1.88 R28.1 62.24,1.65 117.78,1.65 4.2
N$1
  Bottom 1.016: R6.1 15.5,57.89 PWR.K
N$2
  Bottom 1.016: TIMER_555.5 42.6,82.76 | 42.6,82.76 42.6,82.5 | 42.6,82.76 42.6,82.96 C1.1
N$3
  Bottom 1.016: TIMER_555.7 33.42,85.91 32.11,87.22 R1.1 27,87.22 27,83.39 R2.2
N$4
  Bottom 1.016: R1.2 35.96,84.45 TIMER_555.6 35.96,81.96 34.06,80.06 34.06,77.36 33.62,76.92 33.62,75.14 | C2.1 33.62,75.14 | 33.62,75.14 TIMER_555.2
N$6
  Bottom 1.016: Q6.G 97.02,67.42 R22.1
  pour Bottom: 98.8,69.2 89.8,69.2 89.4,68.8 89.3,68.8 88.5,68 88.5,66.4 89.2,65.7 98.6,65.7 99.1,66.2 99.1,68.9
N$7
  Bottom 1.016: M1B.1 13.09,2.16 M1A.1 13.75,2.1 36.1,2.1 | 36.1,2.1 36.1,3.03 R20.2 | 36.1,2.1 44.8,2.1 | 44.8,2.1 44.9,2 | 44.8,2.1 44.59,2.31 M2A.1 53.99,2.36 M2B.1
N$9
  pour Bottom (isolate 0.406): 128.55,129.4 122.3,129.4 122.3,122.7 129.65,122.7 129.65,138.1 124,138.1 124,135.5 128.55,135.5
N$10
  pour Bottom (isolate 0.406): 98.5,123.5 85.1,123.5 85.1,119.1 98.5,119.1
N$12
  Bottom 1.016: R8.2 86.39,113.17 79.66,106.44 65.17,106.44 60.15,101.42 1.4
N$13
  Bottom 1.016: R7.2 117.77,136.66 99.4,136.66 99.4,117.6 85.4,117.6 77.85,110.05 63.25,110.05 59.5,106.3 54.8,106.3 53.15,107.95 1.7
N$14
  Bottom 1.016: C10.2 40.93,102.12 D17.C 45.67,99.35 D3.A
N$15
  Bottom 1.016: Q3.G 91.91,93.64 R10.1
  pour Bottom (isolate 0.406): 87.7,88.4 99.2,88.4 99.2,95.9 87.7,95.9
N$16
  pour Bottom (isolate 0.406): 122.9,94.9 122.9,87.4 129.65,87.4 129.65,94.9
N$17
  Bottom 1.016: R10.2 91.75,82.88 75.2,82.88 75.2,75.7 67.6,75.7 67.6,73.28 2.4
N$18
  Bottom 1.016: R9.2 121.79,85.3 72.5,85.3 72.5,78.1 64.2,78.1 62.41,79.89 2.7
N$19
  Bottom 1.016: R16.1 24.63,24.87 23.48,26.02 T1.2
N$20
  Bottom 1.016: D16.C 54.9,72.74 51.47,72.74 D6.A 50.07,72.84 48.62,74.29 42.88,74.29 C13.2
N$22
  Bottom 1.016: R14.2 10.09,18.51 11.8,16.8 13.6,16.8 | 13.6,16.8 13.6,13.63 R15.1 | T3.3 15.76,16.8 13.6,16.8
N$24
  Bottom 1.016: T1.3 17.99,24.47 R13.1 16.4,24.51 16.4,26.5 15.48,26.5 11.99,29.99 R12.2
N$25
  Bottom 1.016: R21.1 127.7,81.4 129.4,81.4 129.4,71.6 Q5.G
  pour Bottom (isolate 0.406): 128.9,73.5 122.6,73.5 122.6,69.4 129.85,69.4 129.85,85.4 125,85.4 125,80.4 128.9,80.4
N$26
  Bottom 1.016: R22.2 90.08,44.48 86.01,40.41 3.4
N$27
  Bottom 1.016: T3.2 21.41,18.73 R19.1 25.29,18.86 29.78,18.86 T2.3
N$28
  Bottom 1.016: R17.1 30.38,24.43 T2.2
N$30
  Bottom 1.016: R21.2 100.7,82.02 100.7,70.2 100.5,70 100.5,64.6 87.8,64.6 86.2,63 86.2,47.5 84.2,45.5 79.1,45.5 77.82,46.78 3.7
N$31
  Bottom 1.016: C18.2 63.08,39.22 D15.C 67.24,37.88 D9.A
N$32
  Bottom 1.016: Q8.G 98.14,35.54 R24.1
  pour Bottom (isolate 0.406): 98.4,29.3 93.5,29.3 93.5,35.5 93.5,37 94.1,37.6 95.2,38.7 99.1,38.7 99.1,30
N$33
  pour Bottom (isolate 0.406): 129.7,38.2 124.1,38.2 124.1,32.1 124.1,27.9 128.6,27.9 129.7,27.9
N$34
  Bottom 1.016: 4.4 128.9,8.61 128.9,25.1 128.1,25.9 102.24,25.9 101.98,25.64 R24.2
N$35
  Bottom 1.016: 4.7 117.78,13.52 117.8,13.5 124.1,13.5 125.15,14.55 125.65,15.05 127.1,16.5 127.1,23.6 R23.2
N$36
  Bottom 1.016: C21.2 95.74,11.03 103.57,11.03 106.1,8.5 D12.A 106.75,7.92 110.6,7.92 D14.C
N$37
  Bottom 1.016: T6.3 71.42,11.26 65.97,11.26 R29.1 65.4,10.1 65.1,9.8 R28.2
N$38
  Bottom 1.016: R27.1 51.35,11.66 R26.2 59.16,11.66 61.6,14.1 73.1,14.1 73.2,14.2 73.2,18.74 T4.3
N$39
  Bottom 1.016: R30.1 80.3,14.83 80.3,18.92 T4.2
N$40
  Bottom 1.016: T6.2 79.43,9.96 R33.1 83.89,7.82 T5.3
N$41
  Bottom 1.016: R31.1 84.91,11.01 T5.2
N$45
  Bottom 1.016: 94.03,107.2 1B.A 93.93,112.57 | 94.03,107.2 94.03,106.48 1A.K | R34.1 90.85,107.2 94.03,107.2
N$46
  Bottom 1.016: 96.26,51.93 B2.K 96.18,55 | 96.18,55 96.18,56.97 2A.A | R35.1 95.22,54.04 96.18,55
PWM1
  Bottom 1.016: R15.2 12.91,21.19 11.99,22.11 R12.1 11.89,23.87 R11.1 7.64,8.76 11.5,4.9 17.5,4.9 18.6,3.8 23.4,3.8 23.45,3.85 PINHEADER.2
PWM2
  Bottom 1.016: PINHEADER.4 28.53,4.57 29.3,3.8 32.6,3.8 34.45,5.65 47.45,5.65 47.9,6.1 47.9,8.9 | 47.9,8.9 46.2,10.6 46.2,19.3 46.26,19.36 R25.1 48.39,16.6 54.59,16.6 R26.1 | R29.2 63.21,6.4 60.5,6.4 57.4,9.5 48.5,9.5 47.9,8.9
TIMER  (via drill 0.8)
  Top 1.016: v20.3,98.5 35.2,98.5 v35.4,98.7 | v41.7,68.5 v41.7,60.3 | v56.8,56.4 56.2,57 v41.2,57 | v58.9,24.4 58.9,38.3 v58.8,38.3
  Bottom 1.016: C13.1 42.19,77.5 37.22,77.5 35.96,76.24 TIMER_555.3 35.96,71.24 38.7,68.5 v41.7,68.5 | v20.3,98.5 18.1,98.5 18.1,85.1 21.3,85.1 21.3,66.2 27.05,60.45 41.55,60.45 v41.7,60.3 40.4,59 40.4,57.8 v41.2,57 | C10.1 40.05,98.7 v35.4,98.7 | 60.44,43.7 C18.1 58.7,43.7 | 95.1,13.61 C21.1 93.31,13.27 93.31,23 92,24.3 79,24.3 77.8,23.1 71.6,23.1 70.3,24.4 v58.9,24.4 | v56.8,56.4 55.6,55.2 55.6,45.9 57.8,43.7 58.7,43.7 | v58.8,38.3 58.8,43.6 58.7,43.7
VB1
  Bottom 1.016: 50.21,113 50.21,109.44 1.8 | 50.21,113 48.15,113 D3.C 47.02,112.23 D1.C | C8.+ 50.51,113.3 50.21,113
VB2
  Bottom 1.016: D5.C 47.13,85.54 D6.C 51.37,80.2 59.87,80.2 2.8 60.21,80.9 59.71,81.4 C11.+
VB3
  Bottom 1.016: 75.01,50.5 75.01,48.3 | D9.C 74.93,50.58 | 74.93,50.58 75.01,50.5 | 75.01,50.5 75.11,50.4 | D8.C 73.11,53.71 70.2,50.8 | C16.+ 75.21,50.86 74.93,50.58
  pour Bottom (isolate 0.406): 76.2,56.6 71,56.6 70.2,55.8 69.4,55 69.4,50.2 69.4,49.3 70.6,48.1 72.2,46.5 76.3,46.5 76.3,56.5
VB4
  Bottom 1.016: D11.C 101.73,19.97 D12.C 106.1,17.7 108.5,15.3 114.31,15.3 4.8 115.18,16.29 115.18,19.88 C19.+
VCC  (via drill 0.8)
  Top 1.016: v35.3,96.4 22.1,96.4 v22,96.3 | v45.1,68.5 45.1,62.9 v45,62.8 | v73.4,36.3 72.9,35.8 v72.9,26.1 | v57.7,53.1 57.5,52.9 41.2,52.9 v40.7,53.4
  Bottom 0.203: C17.1 75.28,36.25 75.28,36.5
  Bottom 1.016: 2.1 57.1,73.28 57.1,70.54 | 57.1,70.54 57.1,69.38 48.63,69.38 D5.A 47.13,70.9 45.1,70.9 | 36.3,96.3 50.15,96.3 51.18,97.33 C9.1 50.61,98.7 1.1 49.33,102.7 46.15,102.7 34.32,114.53 D1.A | 36.3,96.3 35.4,96.3 | 57.1,70.54 C12.1 | TIMER_555.4 38.36,75 38.36,71.6 39.06,70.9 45.1,70.9 | 36.3,96.3 36.2,96.4 v35.3,96.4 | 23.3,81.2 30.82,81.2 30.88,81.26 TIMER_555.8 30.88,81.36 32.3,79.94 32.3,78.3 31.45,77.45 28.55,77.45 27.06,75.96 R2.1 27.06,72.21 C22.1 | 23.3,81.2 23,81.2 23,66.9 27.1,62.8 v45,62.8 | 23.3,81.2 23.3,86.94 20.39,86.94 20.39,96.1 21.8,96.1 v22,96.3 22.19,96.49 22.19,104.06 19.59,104.06 18.99,104.66 U$2.OUT+ 18.63,105.4 14,105.4 14,81.1 17.5,81.1 17.5,76.8 | v45.1,68.5 45.1,70.9 | 75.28,35.9 75.28,36.5 3.1 74.39,41.3 68.2,41.3 65.3,44.2 63.7,44.2 60.65,47.25 60.65,53.1 | 17.5,76.8 17.5,68.6 | 17.5,68.6 17.5,63.3 23.99,56.81 | D8.A 60.65,55.2 60.65,53.1 | C17.1 73.86,35.84 v73.4,36.3 | 60.65,53.1 v57.7,53.1 | v40.7,53.4 37.6,53.4 35.5,55.5 25.3,55.5 23.99,56.81 | C4.+ 15.21,76.8 17.5,76.8 | C23.1 14.17,68.6 17.5,68.6 | PWR.A 23.99,56.81 | R19.2 36.56,11.11 R20.1 39.1,13.65 39.1,25.4 40.5,26.8 72.2,26.8 v72.9,26.1 73,26 93.3,26 95.05,24.25 95.05,16.85 95.2,16.7 96.8,16.7 96.98,16.52 C20.1 97.26,14.84 97.9,14.2 100,14.2 100.1,14.1 | 100.1,14.1 103.1,14.1 105.8,11.4 112,11.4 114.79,8.61 4.1 115.24,4.3 101.1,4.3 D11.A 93,7.9 92.7,7.6 92.7,3.5 R33.2 | 100.1,14.1 99.4,14.1
  pour Bottom (isolate 0.406): 22.9,108.7 12,108.7 11.2,107.9 11.2,103 11.6,102.6 23,102.6 23,108.4 23.1,108.5
  pour Bottom (isolate 0.406): 76.4,35.7 76.4,41.2 75.2,42.4 73.3,42.4 72.8,41.9 72.8,35.2 73,35 73.1,34.9 76.3,34.9 76.4,35

### Text on the board
tNames: Half H Bridge | Half H Bridge | Half H Bridge | Half H Bridge
tValues: 10k